# Altium schematic sheet 4pin.schdoc
size 49 x 37 mm
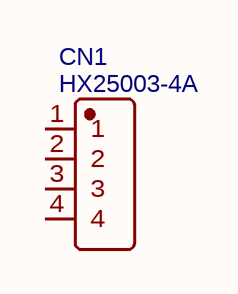
[diagram p0: 4pin.schdoc]

## Parts
CN1  HX25003-4A  [CONN-TH_4P-P2.50_HX25003-4A]

## Nets

Not connected (* = marked no-connect by the designer): CN1 1 2 3 4

## Library data of the parts
CN1 = HX25003-4A: BOM_Manufacturer: HX(Zhejiang Yueqing Hongxing Elec); Contributor: LCSC; BOM_Supplier: LCSC; BOM_Supplier Part: C442301; BOM_Manufacturer Part: HX25003-4A; BOM_JLCPCB Part Class: Extended Part; spicePre: C; spiceSymbolName: HX25003-4A